# EAGLE design Separator-C (EAGLE 9.6.2)
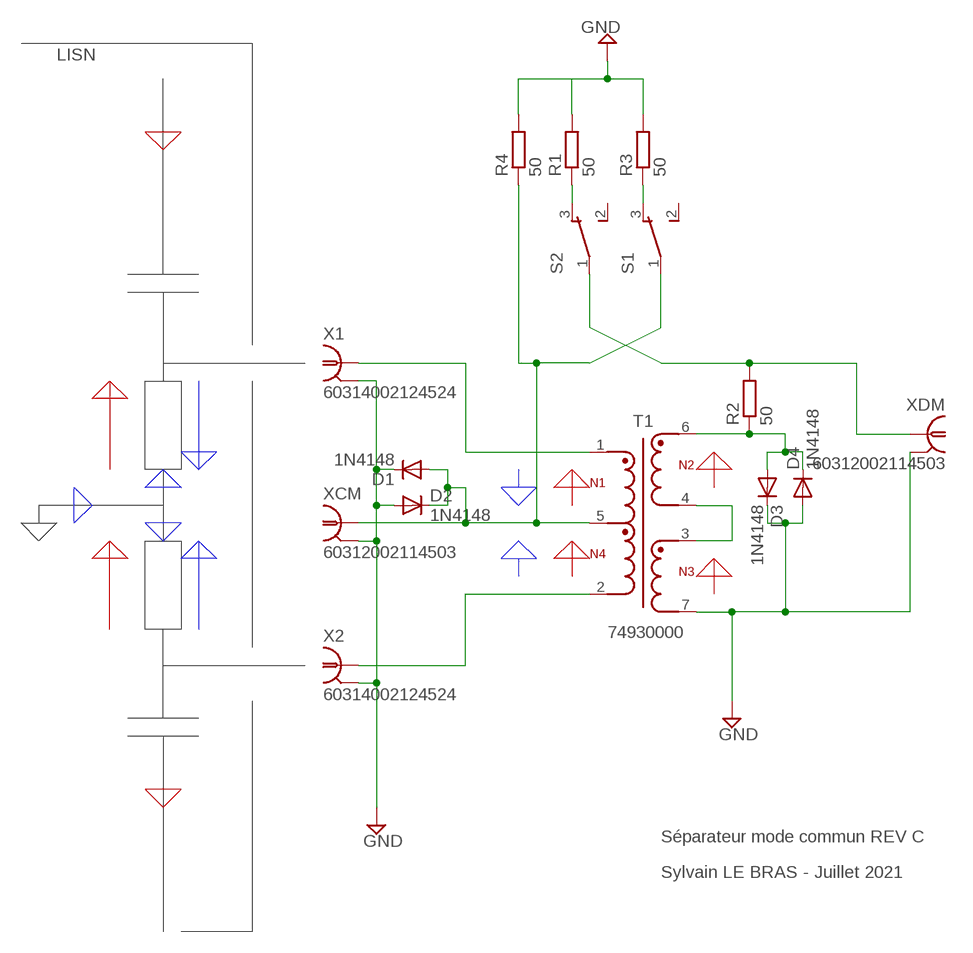
[diagram p0: schematic, sheet 1]

## Parts
D1  1N4148  DIODE-SOD123  [SOD123]
D2  1N4148  DIODE-SOD123  [SOD123]
D3  1N4148  DIODE-SOD123  [SOD123]
D4  1N4148  DIODE-SOD123  [SOD123]
R1  50  R-EU_R0805  [R0805]
R2  50  R-EU_R0805  [R0805]
R3  50  R-EU_R0805  [R0805]
R4  50  R-EU_R0805  [R0805]
S1  450301014042  [450301014042]
S2  450301014042  [450301014042]
T1  74930000  WE-STST_4532_74930000  [WE-STST_74930000]
X1  60314002124524  LTI-SASF54GT  [LTI-SASF54GT]
X2  60314002124524  LTI-SASF54GT  [LTI-SASF54GT]
XCM  60312002114503  LTI-SASF54GT  [LTI-SASF54GT]
XDM  60312002114503  LTI-SASF54GT  [LTI-SASF54GT]

## Nets
GND: D1.C D2.A D3.C D4.A R1.2 R3.2 R4.2 T1.7 X1.2(GND) X2.2(GND) XCM.2(GND) XDM.2(GND)
N$1: T1.1 X1.1
N$2: T1.2 X2.1
N$3: R3.1 S1.3
N$4: D1.A D2.C R4.1 S1.1 T1.5 XCM.1
N$5: D3.A D4.C R2.1 T1.6
N$6: T1.3 T1.4
N$7: R1.1 S2.3
N$8: R2.2 S2.1 XDM.1
Unconnected: S1.2 S2.2

## Notes on the sheet
- LISN
- Séparateur mode commun REV C
- Sylvain LE BRAS - Juillet 2021

## Power pins joined to a net without a drawn wire
GND: X1.3(GND) X1.4(GND) X1.5(GND) X2.3(GND) X2.4(GND) X2.5(GND) XCM.3(GND) XCM.4(GND) XCM.5(GND) XDM.3(GND) XDM.4(GND) XDM.5(GND)

## Library data of the parts
D1-D4 = diode:DIODE-: DIODE
R1-R4 = resistor:R-EU_: RESISTOR, European symbol
S1 S2 = EAGLE-SLIDE_SWITCHES-rev16e:450301014042: 10x2.5 mm THT WS-SLTV <http://katalog.we-online.de/media/images/v2/Family_WS-SLTV_THT_Mini_Slide_Switch_450301014042.jpg> Details see: http://katalog.we-online.de/en/em/SLTV_10X2_5_THT 2015 (C) Wurth Elektronik
T1 = 74930000_Eagle_WE-STST_rev19a:WE-STST_4532: WE-STST Super Tiny Signal Transformer Characteristics Super small size 1.5 kV isolation voltage 350 µH OCL as per IEEE 802.3 Operating temperature: -40 °C up to +105 °C Applications Ethernet 10/100/1000 Base-T Ethernet 2.5/5G and 10G Base-T Single Pair Ethernet Ultrasonic sensors g.fast <hhttps://katalog.we-online.com/media/images/v2/o156816v209%20Family_WE-STST_74930000.jpg> Details see: https://katalog.we-online.com/en/pbs/WE-STST Created by Ella Wu 2019-11-06 2019(C) Wurth Elektronik; DATA-RATE: 10/100/1000 Base-T, 10/100 Base-T1; DATASHEET-URL: https://katalog.we-online.com/pbs/datasheet/74930000.pdf; L: 350uH; MOUNT: SMT; PART-NUMBER: 74930000; PORTS: 1:1; VT: 1500 V (RMS)
X1 X2 XCM XDM = con-coax:LTI-SASF54GT: SMA vertical PCB thrue hole jack Source: Lighthorse Technologies, inc. SASF54GT.pdf; OC_FARNELL: unknown; OC_NEWARK: unknown

## Board
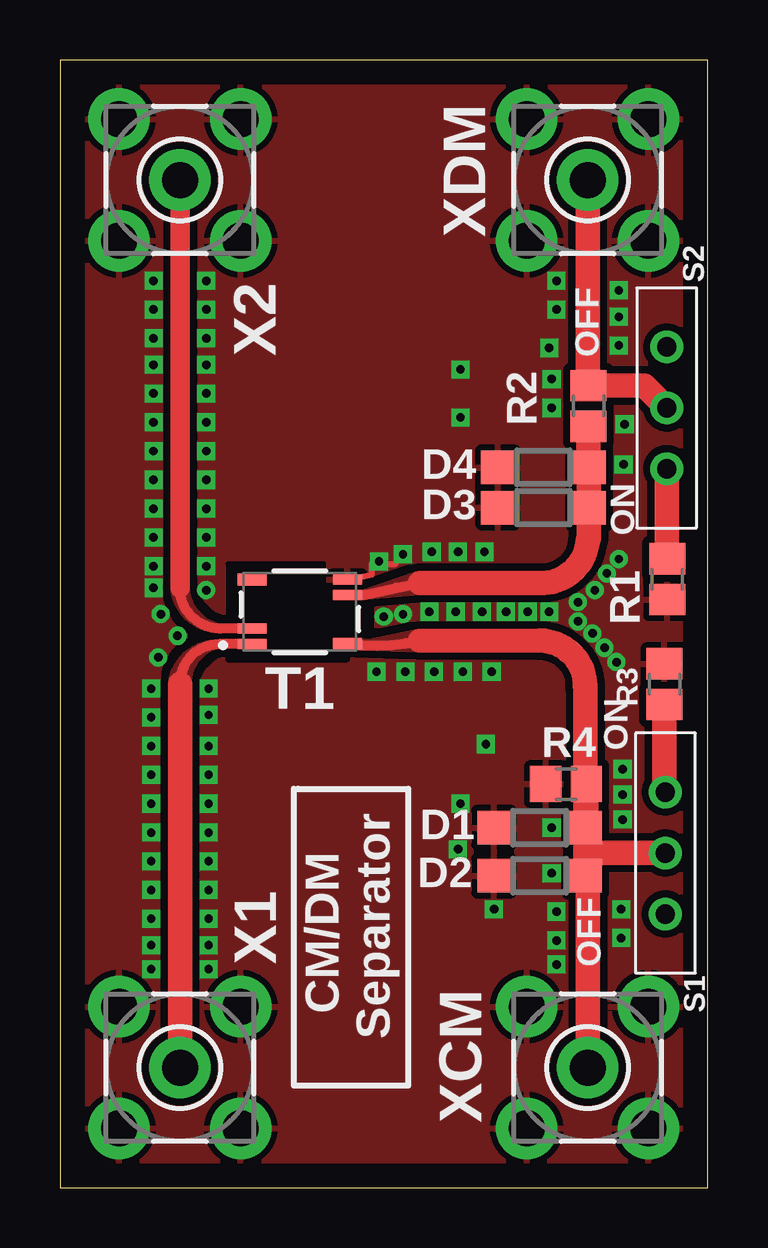
[diagram p1: board, top side]
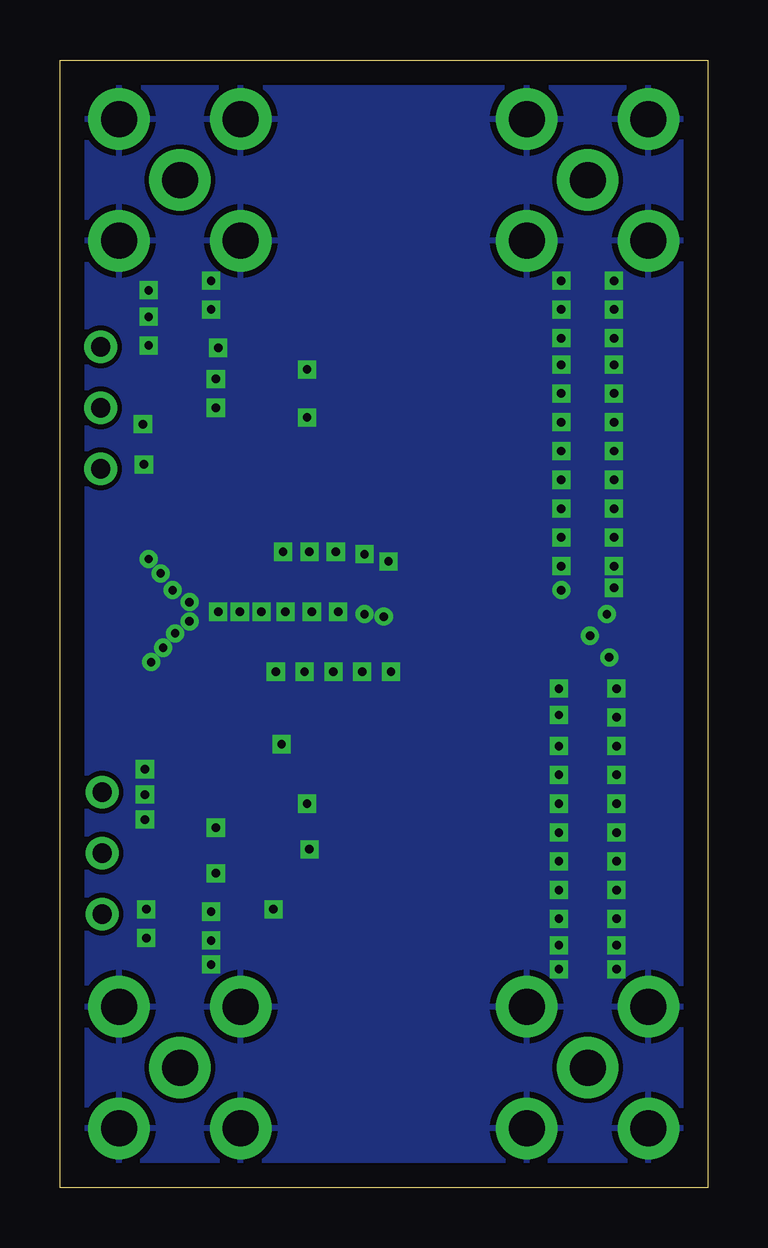
[diagram p2: board, bottom side, seen from below]

Size 27 x 47 mm. Coordinates in mm from the lower left corner, seen from the top.
Outline: 0,0 27,0 27,47 0,47 0,0
Copper layers (1*16): Top 0.035mm / dielectric 1.5mm / Bottom 0.035mm
Design rules "default *": minimum track width 10mil, minimum drill 0.3mm, track to track 8mil, track to pad 8mil, pad to pad 8mil, via to via 8mil, smd to smd 8mil, copper to edge 40mil, drill to drill 8mil, minimum pad ring 10mil, minimum via ring 8mil, stop-mask expansion 0.1mm, vias tented up to drill 0.4mm, thermal gap 10mil

### Footprints (pad centres in the part's own frame; a part is rotated, then mirrored left to right if it is on the bottom)
SOD123 = smd 1.4 x 1.4: A 1.9,0; C -1.9,0
R0805 = smd 1.3 x 1.5: 1 -0.85,0; 2 0.85,0
450301014042 = drill 0.8: 1 0,0; 2 -2.54,0; 3 2.54,0
WE-STST_74930000 = smd 1.2 x 0.41: 1 -1.99,-1.35; 2 -1.99,-0.7; 6 1.99,0.7; 7 1.99,1.35 | smd 0.6 x 0.5: 3 -2.29,1.35; 4 -1.69,1.35 | smd 1.2 x 0.5: 5 1.99,-1.35
LTI-SASF54GT = drill 1.5 pad 2.2: 1 0,0; 2 -2.54,2.54; 3 2.54,2.54; 4 2.54,-2.54; 5 -2.54,-2.54

### Placement (x,y rotation side)
D1  20,15 0 top
D2  20,13 180 top
D3  20.16,28.34 0 top
D4  20.16,30.02 180 top
R1  25.32,25.36 270 top
R2  22.04,32.58 90 top
R3  25.2,20.98 90 top
R4  21.1,16.82 180 top
S1  25.24,13.94 90 top
S2  25.3,32.5 270 top
T1  10,24 0 top
X1  5,5 0 top
X2  5,42 0 top
XCM  22,5 0 top
XDM  22,42 0 top

### Tracks (layer width: path | path; a pad name or v marks a point on that pad's centre or on a via)
GND  (via drill 0.35, 0.35 pad 0.45)
  Top 0.254: T1.7 13,25.55 13,26 14,26
  Top 1.016: 18.15,13 D2.A
  other vias: 6.2,20.8 6.2,19.7 6.2,18.4 6.2,17.2 6.2,16 6.2,14.8 6.2,13.6 6.2,12.4 6.2,11.2 6.2,10.1 6.2,9.1 3.8,20.8 3.8,19.6 3.8,18.4 3.8,17.2 3.8,16 3.8,14.8 3.8,13.6 3.8,12.4 3.8,11.2 3.8,10.1 3.8,9.1 4.1,22.1 4.9,23 4.2,23.9 3.9,25 6.1,24.9 14.3,23.9 16.5,24 3.9,37.8 3.9,36.6 3.9,35.4 3.9,34.3 3.9,33.1 3.9,31.9 3.9,30.7 3.9,29.5 3.9,28.3 3.9,27.1 3.9,25.9 6.1,37.8 6.1,36.6 6.1,35.4 6.1,34.3 6.1,33.1 6.1,31.9 6.1,30.7 6.1,29.5 6.1,28.3 6.1,27.1 6.1,25.9 17.6,24 18.6,24 19.5,24 20.4,24 21.6,23.6 15.4,24 13.5,23.8 23.46,17.44 23.46,16.38 23.46,15.34 23.4,11.6 23.4,10.4 20.7,11.5 20.7,10.3 20.7,9.3 23.3,37.4 23.3,36.3 23.3,35.1 20.4,35 20.7,36.6 20.7,37.8 20.5,33.7 20.5,32.5 20.5,13.1 20.5,15 22.8,25.6 22.3,24.9 22.2,23.1 22.7,22.5 23.2,21.9 21.6,24.4 23.3,26.2 13.3,26.1 14.3,26.4 15.5,26.5 16.6,26.5 17.7,26.5 16.7,32.1 16.7,34.1 16.7,16 16.6,14.1 18.1,11.6 17.76,18.48 13.2,21.5 14.4,21.5 15.6,21.5 16.8,21.5 18,21.5 23.54,31.82 23.5,30.14
  pour Top (isolate 0.3, rank 2): 1,1 26,1 26,46 1,46
  pour Bottom: 1.1,46.1 1.1,0.8 26.5,0.9 26.2,46 1.5,46.3
N$1
  Top 0.406: T1.1 6.65,22.65 arc90 5,21
  Top 1.016: X1.1 5,21
  pour Top (no thermals): 5.4,21.1 arc-80 6.8,22.6 6.8,22.7 arc90 4.6,21.1
N$2
  Top 0.406: T1.2 6.68,23.3 arc-90 5,25
  Top 0.813: X2.1 5,25
  pour Top (no thermals): 5.3,25 arc80 6.8,23.4 6.8,23.2 arc-90 4.7,25
N$3
  Top 1.016: S1.3 25.2,16.48 R3.1
N$4
  Top 0.406: T1.5 arc20 15,22.8
  Top 1: 15,22.8 20,22.8
  Top 1.016: XCM.1 22,13 D2.C | D2.C D1.A 21.9,20.9 | 20,22.8 arc-90 21.9,20.9 | 21.9,20.9 arc90 21.88,20.88 | S1.1 21.95,13.94 | 21.95,13.94 R4.1 | D2.C 21.95,13.05 21.95,13.94
  pour Top (no thermals): 13.1,22.8 arc137 13.1,22.5
  pour Top (no thermals): 15,23.2 13.1,22.8 12.6,22.8 12.6,22.5 15,22.4
N$5
  Top 0.406: T1.6 12.7,24.7 14,25 15,25.2
  Top 1.016: 15,25.2 20,25.2 arc90 22,27 22.06,27.06 D3.A D4.C 22.04,30.04 R2.1
  pour Top (no thermals): 14.9,25.6 12.6,24.8 12.6,24.6 15,24.8
  pour Top (no thermals): 14.9,25.6 12.6,24.8 12.6,24.6 15,24.8
  pour Top (no thermals): 14.9,25.6 12.6,24.8 12.6,24.6 15,24.8
N$6
  Top 0.254: T1.3 T1.4
N$7
  Top 1.016: R1.1 25.3,26.21 S2.3
N$8
  Top 1.016: S2.1 24.37,33.43 R2.2 22,33.47 XDM.1
N$9
  cutout Top: 7,26 7,22 12,22 12,23 13,23 13,24 12,24 12,25 11,25 11,26

### Text on the board
tNames: OFF | ON | ON | CM/DM / Separator | OFF
bStop: Recommended use / 150 kHz - 30 MHz | When ON the switches / terminates outputs / with 50 Ohm
203bmp: C:/Users/sylvain.lebras/Documents/eagle/Academy.bmp | C:/Users/sylvain.lebras/Documents/eagle/Academy.bmp